# EAGLE design nixie-fader_rev3 (EAGLE 7.2.0)
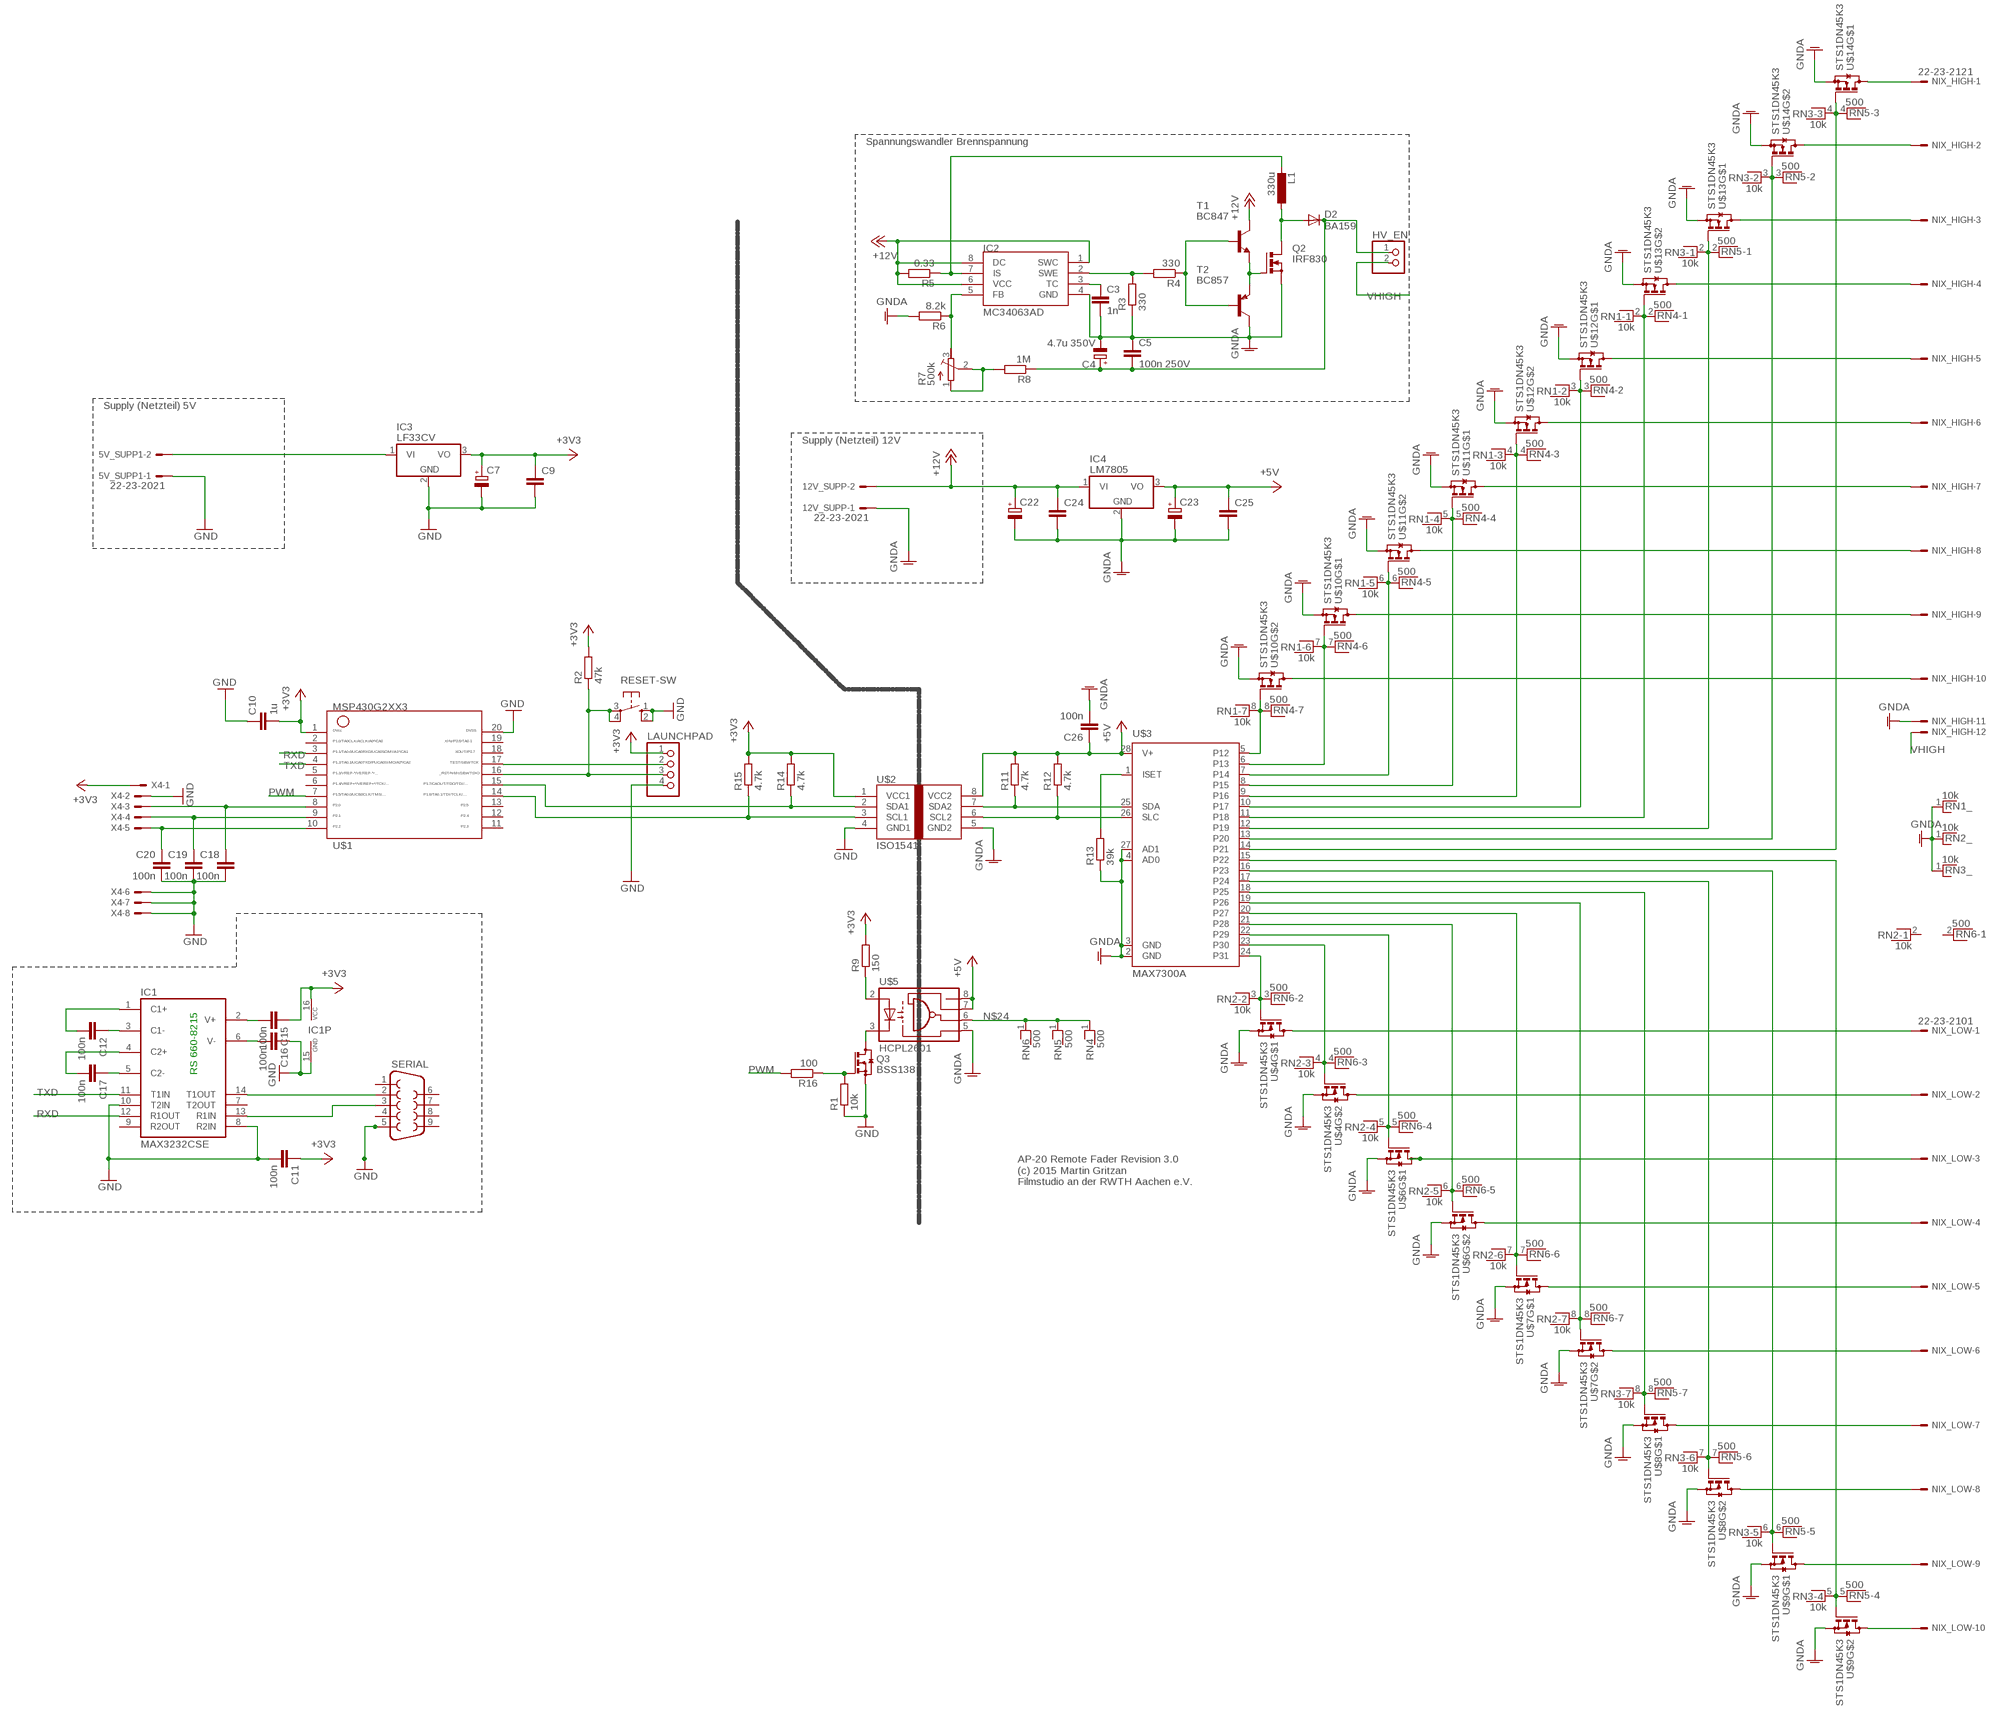
[diagram p0: schematic, sheet 1]

## Parts
5V_SUPP1  22-23-2021  [22-23-2021]
12V_SUPP  22-23-2021  [22-23-2021]
C3  1n  C-EUC0805  [C0805]
C4  4.7u 350V  CPOL-EUE5-8.5  [E5-8,5]
C5  100n 250V  C-EU050-024X044  [C050-024X044]
C7  CPOL-EU140CLH-0810  [140CLH-0810]
C9  C-EUC0805K  [C0805K]
C10  1u  C-EUC0805K  [C0805K]
C11  100n  C-EUC0805  [C0805]
C12  100n  C-EUC0805  [C0805]
C15  100n  C-EUC0805  [C0805]
C16  100n  C-EUC0805  [C0805]
C17  100n  C-EUC0805  [C0805]
C18  100n  C-EUC0805  [C0805]
C19  100n  C-EUC0805  [C0805]
C20  100n  C-EUC0805  [C0805]
C22  CPOL-EU140CLH-0810  [140CLH-0810]
C23  CPOL-EU140CLH-0810  [140CLH-0810]
C24  C-EUC0805K  [C0805K]
C25  C-EUC0805K  [C0805K]
C26  100n  C-EUC0805  [C0805]
D2  BA159  BA157  [P1-10]
HV_EN  PINHD-1X2  [1X02]
IC1  MAX3232CSE  [SO16]
IC2  MC34063AD  [SOIC8]
IC3  LF33CV  7805TV  [TO220V]
IC4  LM7805  7805TV  [TO220V]
L1  330u  L-EUIRF-36  [IRF36]
LAUNCHPAD  PINHD-1X4  [1X04]
NIX_HIGH  22-23-2121  [22-23-2121]
NIX_LOW  22-23-2101  [22-23-2101]
Q2  IRF830  IRF512  [TO220BV]
Q3  BSS138  BSS123  [SOT23]
R1  10k  R-EU_M0805  [M0805]
R2  47k  R-EU_R0805  [R0805]
R3  330  R-EU_M0805  [M0805]
R4  330  R-EU_M0805  [M0805]
R5  0.33  R-EU_M0805  [M0805]
R6  8.2k  R-EU_M0805  [M0805]
R7  500k  R-TRIMM3296Y  [RTRIM3296Y]
R8  1M  R-EU_M0805  [M0805]
R9  150  R-EU_M0805  [M0805]
R11  4.7k  R-EU_M0805  [M0805]
R12  4.7k  R-EU_M0805  [M0805]
R13  39k  R-EU_M0805  [M0805]
R14  4.7k  R-EU_M0805  [M0805]
R15  4.7k  R-EU_M0805  [M0805]
R16  100  R-EU_M0805  [M0805]
RESET-SW  10-XX  [B3F-10XX]
RN1  10k  RNX7  [RN-8]
RN2  10k  RNX7  [RN-8]
RN3  10k  RNX7  [RN-8]
RN4  500  RNX7  [RN-8]
RN5  500  RNX7  [RN-8]
RN6  500  RNX7  [RN-8]
SERIAL  F09H  [F09H]
T1  BC847  [SOT23]
T2  BC857  BC857ASMD  [SOT23-BEC]
U$1  G2XX3---PW20  [PW20]
U$2  ISO1541  [SOIC8]
U$3  MAX7300A  [SSOP28]
U$4  STS1DN45K3  [SO08]
U$5  HCPL2601  [DIP8-SMD]
U$6  STS1DN45K3  [SO08]
U$7  STS1DN45K3  [SO08]
U$8  STS1DN45K3  [SO08]
U$9  STS1DN45K3  [SO08]
U$10  STS1DN45K3  [SO08]
U$11  STS1DN45K3  [SO08]
U$12  STS1DN45K3  [SO08]
U$13  STS1DN45K3  [SO08]
U$14  STS1DN45K3  [SO08]
X4  22-23-2081  [22-23-2081]

## Nets
+3V3: C7.+ C9.1 C10.2 C11.1 C15.1 IC1.16(VCC) IC3.3(VO) LAUNCHPAD.1 R2.2 R9.2 R14.2 R15.2 U$1.1 U$2.1(VCC1) X4.1
+5V: C23.+ C25.1 C26.1 IC4.3(VO) R11.2 R12.2 U$2.8(VCC2) U$3.28(V+) U$5.7(EN) U$5.8(VCC)
+12V: 12V_SUPP.2 C22.+ C24.1 IC2.1(SWC) IC2.6(VCC) IC2.8(DC) IC4.1(VI) R5.2 T1.3(C)
GND: 5V_SUPP1.1 C7.- C9.2 C10.1 C11.2 C16.1 C18.2 C19.2 C20.2 IC1.8(R2IN) IC1.10(T2IN) IC1.15(GND) IC3.2(GND) LAUNCHPAD.4 Q3.2(S) R1.1 RESET-SW.1(S) RESET-SW.2(S1) SERIAL.5 U$1.20 U$2.4(GND1) X4.2 X4.6 X4.7 X4.8
GNDA: 12V_SUPP.1 C3.2 C4.- C5.1 C22.- C23.- C24.2 C25.2 C26.2 IC2.4(GND) IC4.2(GND) NIX_HIGH.11 Q2.S R3.1 R6.2 R13.1 RN1.1 RN2.1 RN3.1 T2.C U$2.5(GND2) U$3.2(GND) U$3.3(GND) U$3.4(AD0) U$3.27(AD1) U$4.1(S) U$4.3(S) U$5.5(GND) U$6.1(S) U$6.3(S) U$7.1(S) U$7.3(S) U$8.1(S) U$8.3(S) U$9.1(S) U$9.3(S) U$10.1(S) U$10.3(S) U$11.1(S) U$11.3(S) U$12.1(S) U$12.3(S) U$13.1(S) U$13.3(S) U$14.1(S) U$14.3(S)
N$1: Q3.1(G) R1.2 R16.1
N$3: C12.1 IC1.3(C1-)
N$5: C3.1 IC2.3(TC)
N$6: IC2.2(SWE) R3.2 R4.2
N$7: R4.1 T1.1(B) T2.B
N$8: C17.1 IC1.5(C2-)
N$9: C17.2 IC1.4(C2+)
N$10: C16.2 IC1.6(V-)
N$11: C15.2 IC1.2(V+)
N$13: LAUNCHPAD.3 R2.1 RESET-SW.3(P) RESET-SW.4(P1) U$1.16
N$14: C12.2 IC1.1(C1+)
N$15: R11.1 U$2.7(SDA2) U$3.25(SDA)
N$16: IC1.14(T1OUT) SERIAL.2
N$17: R12.1 U$2.6(SCL2) U$3.26(SLC)
N$18: Q2.G T1.2(E) T2.E
N$19: D2.A L1.1 Q2.D
N$20: IC2.7(IS) L1.2 R5.1
N$21: IC2.5(FB) R6.1 R7.3(A)
N$22: R7.1(E) R7.2(S) R8.2
N$23: C18.1 U$1.8 X4.3
N$24: RN4.1 RN5.1 RN6.1 U$5.6(OUT)
N$25: C19.1 U$1.9 X4.4
N$26: NIX_HIGH.2 U$14.5(D) U$14.6(D)
N$27: C20.1 U$1.10 X4.5
N$28: Q3.3(D) U$5.3(C)
N$29: R9.1 U$5.2(A)
N$30: RN2.3 RN6.3 U$3.24(P31) U$4.2(G)
N$31: RN1.8 RN4.8 U$3.5(P12) U$10.4(G)
N$32: RN2.4 RN6.4 U$3.23(P30) U$4.4(G)
N$33: RN1.7 RN4.7 U$3.6(P13) U$10.2(G)
N$34: LAUNCHPAD.2 U$1.17
N$35: RN2.5 RN6.5 U$3.22(P29) U$6.2(G)
N$36: RN2.6 RN6.6 U$3.21(P28) U$6.4(G)
N$37: IC1.13(R1IN) SERIAL.3
N$38: R13.2 U$3.1(ISET)
N$39: RN1.6 RN4.6 U$3.7(P14) U$11.4(G)
N$40: RN2.7 RN6.7 U$3.20(P27) U$7.2(G)
N$41: RN2.8 RN6.8 U$3.19(P26) U$7.4(G)
N$42: RN1.5 RN4.5 U$3.8(P15) U$11.2(G)
N$43: RN3.8 RN5.8 U$3.18(P25) U$8.2(G)
N$44: RN3.7 RN5.7 U$3.17(P24) U$8.4(G)
N$45: RN1.4 RN4.4 U$3.9(P16) U$12.4(G)
N$46: RN3.6 RN5.6 U$3.16(P23) U$9.2(G)
N$47: RN3.5 RN5.5 U$3.15(P22) U$9.4(G)
N$48: NIX_HIGH.1 U$14.7(D) U$14.8(D)
N$49: NIX_LOW.1 U$4.7(D) U$4.8(D)
N$50: NIX_LOW.2 U$4.5(D) U$4.6(D)
N$51: R14.1 U$1.15 U$2.2(SDA1)
N$52: NIX_LOW.3 U$6.7(D) U$6.8(D)
N$53: NIX_LOW.4 U$6.5(D) U$6.6(D)
N$54: NIX_LOW.5 U$7.7(D) U$7.8(D)
N$55: NIX_LOW.6 U$7.5(D) U$7.6(D)
N$56: NIX_LOW.7 U$8.7(D) U$8.8(D)
N$57: NIX_LOW.8 U$8.5(D) U$8.6(D)
N$58: NIX_LOW.9 U$9.7(D) U$9.8(D)
N$59: R15.1 U$1.14 U$2.3(SCL1)
N$60: NIX_LOW.10 U$9.5(D) U$9.6(D)
N$61: RN1.3 RN4.3 U$3.10(P17) U$12.2(G)
N$63: RN1.2 RN4.2 U$3.11(P18) U$13.4(G)
N$64: RN3.2 RN5.2 U$3.12(P19) U$13.2(G)
N$65: RN3.3 RN5.3 U$3.13(P20) U$14.4(G)
N$67: 5V_SUPP1.2 IC3.1(VI)
N$68: RN3.4 RN5.4 U$3.14(P21) U$14.2(G)
N$69: NIX_HIGH.3 U$13.7(D) U$13.8(D)
N$70: NIX_HIGH.4 U$13.5(D) U$13.6(D)
N$71: NIX_HIGH.5 U$12.7(D) U$12.8(D)
N$72: NIX_HIGH.6 U$12.5(D) U$12.6(D)
N$73: NIX_HIGH.7 U$11.7(D) U$11.8(D)
N$74: NIX_HIGH.8 U$11.5(D) U$11.6(D)
N$75: NIX_HIGH.9 U$10.7(D) U$10.8(D)
N$76: NIX_HIGH.10 U$10.5(D) U$10.6(D)
PWM: R16.2 U$1.7
RXD: IC1.12(R1OUT) U$1.3
TXD: IC1.11(T1IN) U$1.4
VHIGH: HV_EN.2 NIX_HIGH.12
VHIGH_SUP: C4.+ C5.2 D2.C HV_EN.1 R8.1
Unconnected: IC1.7(T2OUT) IC1.9(R2OUT) RN2.2 RN6.2 SERIAL.1 SERIAL.4 SERIAL.6 SERIAL.7 SERIAL.8 SERIAL.9 U$1.2 U$1.5 U$1.6 U$1.11 U$1.12 U$1.13 U$1.18 U$1.19

## Notes on the sheet
- Spannungswandler Brennspannung
- Supply (Netzteil) 5V
- Supply (Netzteil) 12V
- RS 660-8215
- AP-20 Remote Fader Revision 3.0
  (c) 2015 Martin Gritzan
  Filmstudio an der RWTH Aachen e.V.

## Library data of the parts
5V_SUPP1 12V_SUPP = con-molex:22-23-2021: .100" (2.54mm) Center Header - 2 Pin; MF: MOLEX; MPN: 22-23-2021; OC_FARNELL: 1462926; OC_NEWARK: 25C3832
C3 C11 C12 C15-C20 C26 = resistor:C-EU: CAPACITOR, European symbol
C4 = resistor:CPOL-EU: POLARIZED CAPACITOR, European symbol
C5 C9 C10 C24 C25 = rcl:C-EU: CAPACITOR, European symbol
C7 C22 C23 = rcl:CPOL-EU: POLARIZED CAPACITOR, European symbol
D2 = diode:BA157: DIODE fast soft-recovery controlled avalanche rectifier
HV_EN = pinhead:PINHD-1X2: PIN HEADER
IC1 = maxim:MAX3232*: True RS-232 Transceivers 3.0V to 5.5V, Low-Power up to 1Mbps, Using Four 0.1µF External Capacitors Source: http://pdfserv.maxim-ic.com/en/ds/MAX3222-MAX3241.pdf; MPN: MAX3232CSE; OC_FARNELL: 9725490; OC_NEWARK: 90C2890
IC2 = mc34063:MC34063
IC3 IC4 = linear:78*: Positive VOLTAGE REGULATOR Source: http://cache.national.com/ds/LM/LM78L05.pdf http://www.fairchildsemi.com/ds/LM/LM7805.pdf
L1 = rcl:L-EU: INDUCTOR, European symbol
LAUNCHPAD = pinhead:PINHD-1X4: PIN HEADER
NIX_HIGH = con-molex:22-23-2121: .100" (2.54mm) Center Header - 12 Pin; MF: MOLEX; MPN: 22-23-2121; OC_FARNELL: 1462935; OC_NEWARK: 56H0456
NIX_LOW = con-molex:22-23-2101: .100" (2.54mm) Center Header - 10 Pin; MF: MOLEX; MPN: 22-23-2101; OC_FARNELL: 1756828; OC_NEWARK: 94C0765
Q2 = transistor-power:IRF512: N-CHANNEL MOS FET
Q3 = transistor-small-signal:BSS123: N-CHANNEL MOS FET
R1-R6 R8 R9 R11-R16 = resistor:R-EU_: RESISTOR, European symbol
R7 = resistor:R-TRIMM: Trimm resistor
RESET-SW = switch-omron:10-XX: OMRON SWITCH; MPN: B3F-1000; OC_FARNELL: 176432; OC_NEWARK: 36M3542
RN1-RN6 = resistor-net:RNX7: RESISTOR NETWORK; OC_FARNELL: unknown; OC_NEWARK: unknown
SERIAL = con-subd:F09: SUB-D; OC_FARNELL: unknown; OC_NEWARK: unknown
T1 = transistor:BC847: NPN TRANSISTOR
T2 = transistor-pnp:BC857*: PNP Transistror
U$1 = TI_MSP430_v16:G2XX3---PW20: MSP430G2XX1 TSSOP (PW) 20 Pin Package
U$2 = Standardbauteile_Martin:ISO1541
U$3 = Standardbauteile_Martin:MAX7300A
U$4 U$6-U$14 = Standardbauteile_Martin:STS1DN45K3: outdated dual-MOSFET with >400V rating in SO08-Package
U$5 = Standardbauteile_Martin:HCPL2601
X4 = con-molex:22-23-2081: .100" (2.54mm) Center Header - 8 Pin; MF: MOLEX; MPN: 22-23-2081; OC_FARNELL: 1756826; OC_NEWARK: 01C7592

## Board
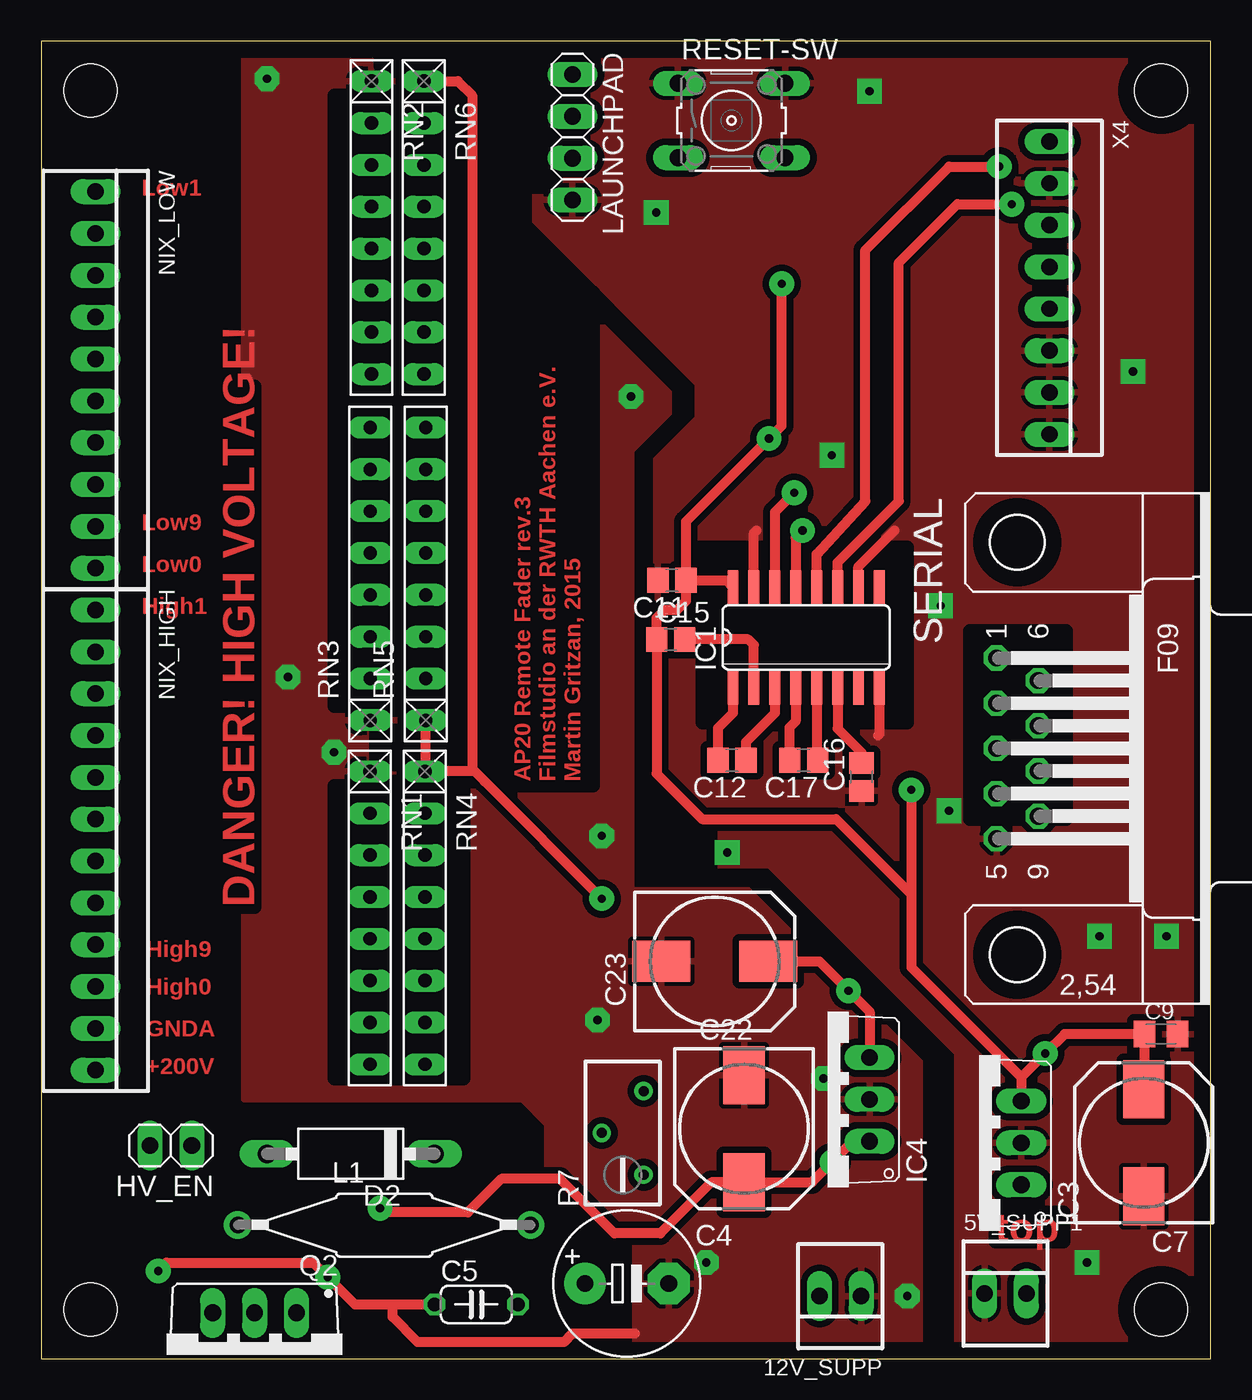
[diagram p1: board, top side]
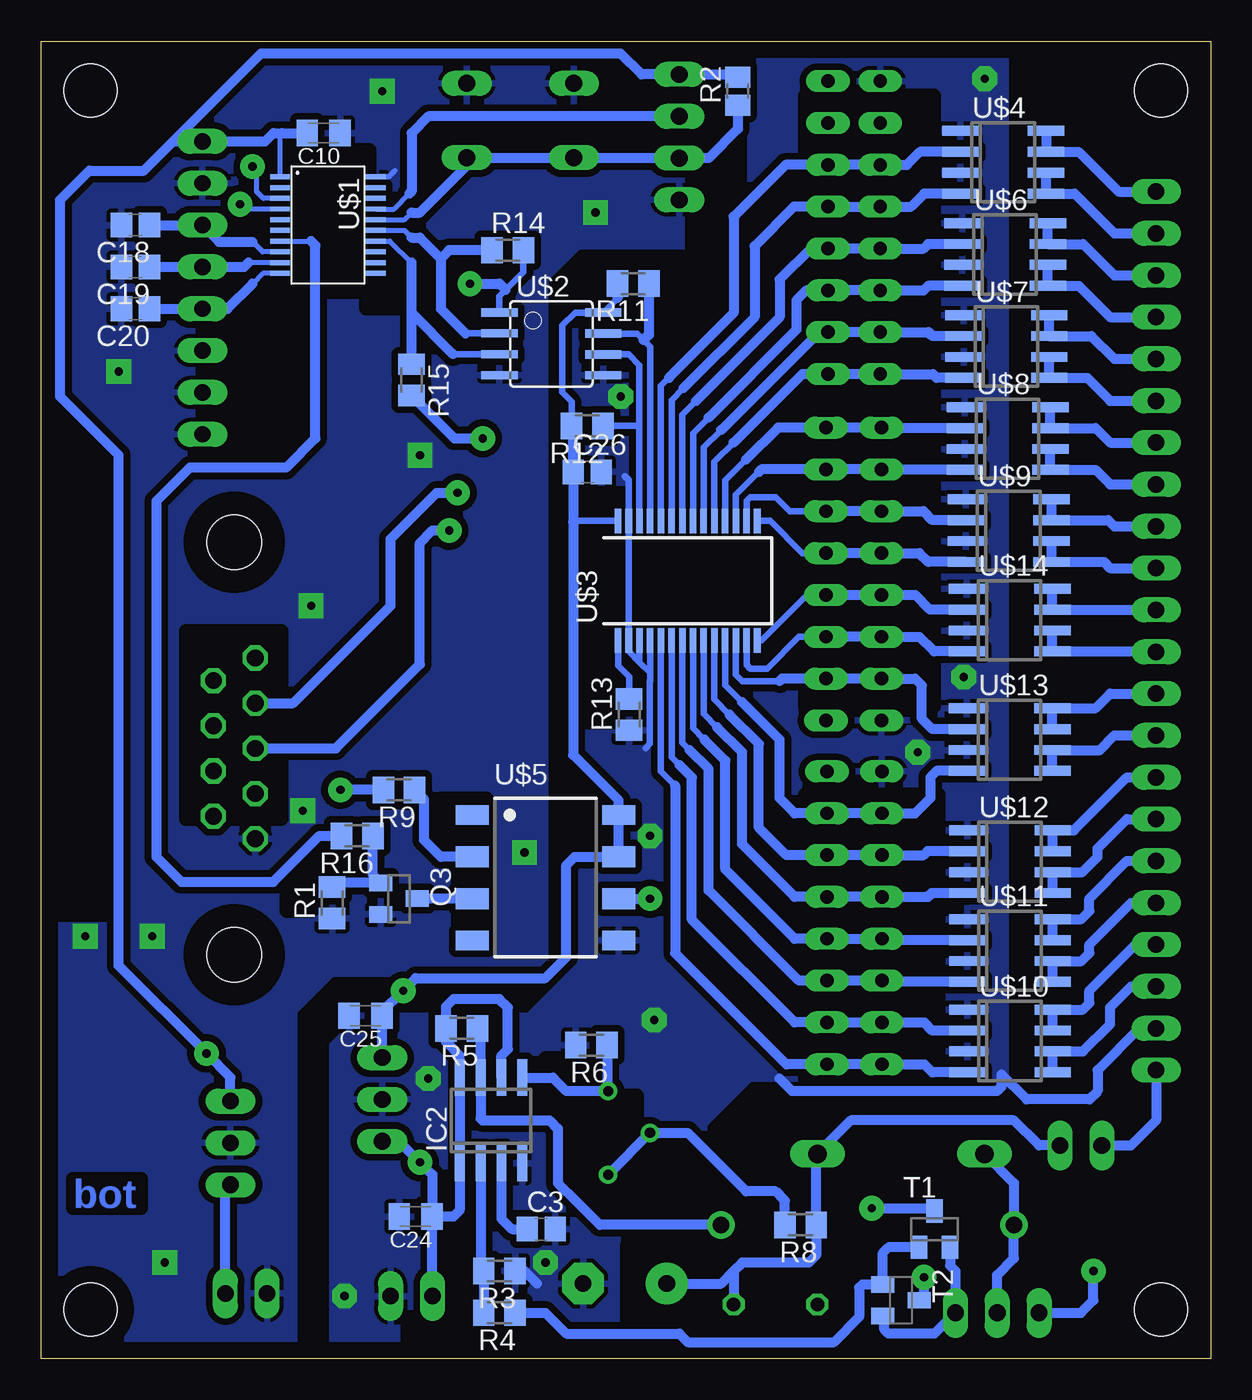
[diagram p2: board, bottom side, seen from below]

Size 71 x 80 mm. Coordinates in mm from the lower left corner, seen from the top.
Outline: 0,0 71,0 71,80 0,80 0,0
Copper layers (1*16): Top 0.035mm / dielectric 1.5mm / Bottom 0.035mm
Design rules "default *": minimum track width 10mil, minimum drill 24mil, track to track 8mil, track to pad 8mil, pad to pad 8mil, via to via 8mil, smd to smd 8mil, copper to edge 40mil, drill to drill 8mil, minimum pad ring 10mil, minimum via ring 8mil, stop-mask expansion 4mil, vias tented up to drill 0mil, thermal gap 10mil
Holes 3.2 mm at 3,77 3,3 68,3 68,77
tRestrict: area 40.1,38.6 to 52.6,49.3; area 17.8,39.6 to 25.4,76.7; area 17.8,17 to 25.7,34.8; area 20.6,78.5 to 21.6,79; area 20.3,36.1 to 22.6,38.1; area 29.5,71.1 to 31.2,72.4; area 39.6,29.2 to 40.6,33; area 27.7,34.8 to 33.5,64.8; area 56.4,32.8 to 62.2,44.2
bRestrict: area 26.2,41.7 to 37.6,52.6; area 51.1,64.8 to 56.4,73.4; area 16.8,39.6 to 24.6,76.7; area 16.5,16.8 to 24.6,34.3; area 34.8,13.5 to 36.6,16; area 46.2,1 to 48.8,2.5; area 43.9,28.7 to 45.7,29.7; area 43.9,31.2 to 46.7,34; area 43.9,26.2 to 45.7,27.2; area 54.6,27.2 to 56.1,29.7; area 56.4,32.8 to 62.2,44.2; area 59.2,54.9 to 61.2,63; 6 more areas

### Footprints (pad centres in the part's own frame; a part is rotated, then mirrored left to right if it is on the bottom)
22-23-2021 = drill 1 long: 1 -1.27,0; 2 1.27,0
C0805 = smd 1.3 x 1.5: 1 -0.85,0; 2 0.85,0
E5-8,5 = drill 1.016 pad 2.54: + -2.54,0 | drill 1.016 pad 2.54 octagon: - 2.54,0
C050-024X044 = drill 0.813 octagon: 1 -2.54,0; 2 2.54,0
140CLH-0810 = smd 3.5 x 2.5: + 3.25,0; - -3.25,0
C0805K = smd 1.3 x 1.6: 1 -1,0; 2 1,0
P1-10 = drill 1.118 long: A 5.08,0; C -5.08,0
1X02 = drill 1.016 long: 1 -1.27,0; 2 1.27,0
SO16 = smd 0.66 x 2.032: 1 -4.445,-3.073; 2 -3.175,-3.073; 3 -1.905,-3.073; 4 -0.635,-3.073; 5 0.635,-3.073; 6 1.905,-3.073; 7 3.175,-3.073; 8 4.445,-3.073; 9 4.445,3.073; 10 3.175,3.073; 11 1.905,3.073; 12 0.635,3.073; 13 -0.635,3.073; 14 -1.905,3.073; 15 -3.175,3.073; 16 -4.445,3.073
SOIC8 = smd 0.6 x 2.2: 1 -1.905,-2.6; 2 -0.635,-2.6; 3 0.635,-2.6; 4 1.905,-2.6; 5 1.905,2.6; 6 0.635,2.6; 7 -0.635,2.6; 8 -1.905,2.6
TO220V = drill 1.016 long: 1 -2.54,-2.54; 2 0,-2.54; 3 2.54,-2.54
IRF36 = drill 1 pad 1.676: 1 -8.89,0; 2 8.89,0
1X04 = drill 1.016 long: 1 -3.81,0; 2 -1.27,0; 3 1.27,0; 4 3.81,0
22-23-2121 = drill 1 long: 1 -13.97,0; 2 -11.43,0; 3 -8.89,0; 4 -6.35,0; 5 -3.81,0; 6 -1.27,0; 7 1.27,0; 8 3.81,0; 9 6.35,0; 10 8.89,0; 11 11.43,0; 12 13.97,0
22-23-2101 = drill 1 long: 1 -11.43,0; 2 -8.89,0; 3 -6.35,0; 4 -3.81,0; 5 -1.27,0; 6 1.27,0; 7 3.81,0; 8 6.35,0; 9 8.89,0; 10 11.43,0
TO220BV = drill 1.016 long: D 0,-2.54; G -2.54,-2.54; S 2.54,-2.54
SOT23 = smd 1 x 1.4: 1 -0.95,-1.1; 2 0.95,-1.1; 3 0,1.1
M0805 = smd 1.3 x 1.6: 1 -0.95,0; 2 0.95,0
R0805 = smd 1.3 x 1.5: 1 -0.85,0; 2 0.85,0
RTRIM3296Y = drill 0.61: 1 1.27,-2.54; 2 -1.27,0; 3 1.27,2.54
B3F-10XX = drill 1.016 long: 1 -3.251,2.261; 2 3.251,2.261; 3 -3.251,-2.261; 4 3.251,-2.261
RN-8 = drill 0.813 long: 1 -8.89,0; 2 -6.35,0; 3 -3.81,0; 4 -1.27,0; 5 1.27,0; 6 3.81,0; 7 6.35,0; 8 8.89,0
F09H = drill 1.016 octagon: 1 -5.486,-1.27; 2 -2.743,-1.27; 3 0,-1.27; 4 2.743,-1.27; 5 5.486,-1.27; 6 -4.115,1.27; 7 -1.372,1.27; 8 1.372,1.27; 9 4.115,1.27 | hole 3.302: -12.522,0; 12.522,0
SOT23-BEC = smd 1 x 1.4: B -0.95,-1.1; C 0,1.1; E 0.95,-1.1
PW20 = smd 0.3 x 1.2: 1 -2.925,-2.9; 2 -2.275,-2.9; 3 -1.625,-2.9; 4 -0.975,-2.9; 5 -0.325,-2.9; 6 0.325,-2.9; 7 0.975,-2.9; 8 1.625,-2.9; 9 2.275,-2.9; 10 2.925,-2.9; 11 2.925,2.9; 12 2.275,2.9; 13 1.625,2.9; 14 0.975,2.9; 15 0.325,2.9; 16 -0.325,2.9; 17 -0.975,2.9; 18 -1.625,2.9; 19 -2.275,2.9; 20 -2.925,2.9
SOIC8' = smd 0.5 x 2.2: 1 -1.905,-3.154; 2 -0.645,-3.154; 3 0.625,-3.154; 4 1.895,-3.154; 5 1.905,3.154; 6 0.635,3.154; 7 -0.635,3.154; 8 -1.905,3.154
SSOP28 = smd 0.4 x 1.5: 1 -4.225,-3.625; 2 -3.575,-3.625; 3 -2.925,-3.625; 4 -2.275,-3.625; 5 -1.625,-3.625; 6 -0.975,-3.625; 7 -0.325,-3.625; 8 0.325,-3.625; 9 0.975,-3.625; 10 1.625,-3.625; 11 2.275,-3.625; 12 2.925,-3.625; 13 3.575,-3.625; 14 4.225,-3.625; 15 4.225,3.625; 16 3.575,3.625; 17 2.925,3.625; 18 2.275,3.625; 19 1.625,3.625; 20 0.975,3.625; 21 0.325,3.625; 22 -0.325,3.625; 23 -0.975,3.625; 24 -1.625,3.625; 25 -2.275,3.625; 26 -2.925,3.625; 27 -3.575,3.625; 28 -4.225,3.625
SO08 = smd 0.6 x 2.2: 1 -1.905,-2.6; 2 -0.635,-2.6; 3 0.635,-2.6; 4 1.905,-2.6; 5 1.905,2.6; 6 0.635,2.6; 7 -0.635,2.6; 8 -1.905,2.6
DIP8-SMD = smd 1.16 x 2: 1 -3.81,-4.45; 4 3.81,-4.45; 5 3.81,4.45; 8 -3.81,4.45 | smd 1.27 x 2: 2 -1.27,-4.45; 3 1.27,-4.45; 6 1.27,4.45; 7 -1.27,4.45
22-23-2081 = drill 1 long: 1 -8.89,0; 2 -6.35,0; 3 -3.81,0; 4 -1.27,0; 5 1.27,0; 6 3.81,0; 7 6.35,0; 8 8.89,0

### Placement (x,y rotation side)
5V_SUPP1  58.55,3.97 0 top
12V_SUPP  48.51,3.81 180 top
C3  40.64,7.87 0 bottom
C4  35.56,4.57 0 top
C5  26.42,3.3 0 top
C7  66.94,13.12 90 top
C9  68,19.72 0 top
C10  53.85,74.42 180 bottom
C11  38.29,47.27 180 top
C12  41.95,36.34 180 top
C15  38.22,43.67 0 top
C16  49.81,35.33 90 top
C17  46.3,36.34 180 top
C18  65.28,68.83 180 bottom
C19  65.28,66.29 180 bottom
C20  65.28,63.75 180 bottom
C22  42.67,13.97 270 top
C23  40.89,24.13 0 top
C24  48.26,8.64 180 bottom
C25  51.31,20.83 180 bottom
C26  37.85,53.85 0 bottom
D2  18.8,12.45 180 top
HV_EN  7.87,12.95 180 top
IC1  46.45,43.8 0 top
IC2  43.69,14.48 0 bottom
IC3  56.97,13.11 90 top
IC4  47.75,15.75 90 top
L1  20.83,8.13 0 top
LAUNCHPAD  32.26,74.17 270 top
NIX_HIGH  3.3,31.5 270 top
NIX_LOW  3.3,59.44 270 top
Q2  12.95,0.25 180 top
Q3  49.28,27.94 270 bottom
R1  53.34,27.69 90 bottom
R2  28.7,76.96 90 bottom
R3  43.18,5.33 180 bottom
R4  43.18,2.79 180 bottom
R5  45.47,20.07 180 bottom
R6  37.59,19.05 180 bottom
R7  35.31,13.72 0 top
R8  24.89,8.13 180 bottom
R9  49.28,34.54 180 bottom
R11  35.05,65.28 180 bottom
R12  37.85,56.64 180 bottom
R13  35.31,39.12 90 bottom
R14  42.67,67.31 0 bottom
R15  48.51,59.44 270 bottom
R16  51.82,31.75 180 bottom
RESET-SW  41.91,75.18 0 top
RN1  19.96,26.77 270 top
RN2  20.05,68.68 270 top
RN3  19.98,47.65 90 top
RN4  23.29,26.77 270 top
RN5  23.35,47.65 90 top
RN6  23.23,68.68 270 top
SERIAL  59.27,37.06 270 top
T1  16.76,7.87 0 bottom
T2  18.8,3.56 270 bottom
U$1  53.59,68.83 270 bottom
U$2  ISO1541  [SOIC8']  40.03,61.62 270 bottom
U$3  31.75,47.24 0 bottom
U$4  12.59,72.65 270 bottom
U$5  40.39,29.21 270 bottom
U$6  12.47,67.05 270 bottom
U$7  12.4,61.46 270 bottom
U$8  12.33,55.87 270 bottom
U$9  12.25,50.29 270 bottom
U$10  12.18,19.3 270 bottom
U$11  12.18,24.79 270 bottom
U$12  12.18,30.19 270 bottom
U$13  12.2,37.6 270 bottom
U$14  12.2,44.85 270 bottom
X4  61.21,65.02 270 top

### Tracks (layer width: path | path; a pad name or v marks a point on that pad's centre or on a via)
+3V3  (via drill 0.5 pad 1.5)
  Top 0.61: C11.1 41.61,47.27 IC1.16 | C11.1 39.14,46 38.61,45.47 37.85,45.47 37.37,44.99 C15.1 37.37,35.53 40.13,32.77 48.26,32.77 52.83,28.19 | C7.+ 67,16.43 C9.1 62.14,19.72 v60.96,18.54 59.51,17.09 | 59.51,17.09 IC3.3 | 52.83,28.19 52.83,23.76 59.51,17.09 | v52.83,34.54 52.83,28.19 | C11.1 39.14,50.83 v44.2,55.88 44.96,56.64 v44.96,65.28
  Bottom 0.305: U$1.1 56.49,74.32 56.39,74.42
  Bottom 0.406: U$2.1 43.18,64.52 42.8,64.9 41.72,65.97 R14.2
  Bottom 0.61: C10.2 56.39,74.42 56.9,74.42 57.4,73.91 X4.1 62.99,73.91 | IC3.3 59.51,17.09 v60.96,18.54 66.29,23.88 66.29,54.86 69.85,58.42 69.85,70.36 68.07,72.14 64.77,72.14 62.99,73.91 | 62.99,73.91 57.66,79.25 35.81,79.25 34.54,77.98 LAUNCHPAD.1 28.87,77.98 R2.2 | R9.2 v52.83,34.54 | R15.2 45.91,55.88 v44.2,55.88 | v44.96,65.28 43.18,65.28 42.8,64.9
+5V  (via drill 0.5 pad 1.5)
  Top 0.61: C23.+ 47.24,24.13 v49.02,22.35 50.29,21.08 IC4.3
  Bottom 0.406: 36,64.39 U$2.8 38.59,63.52 39.37,62.74 39.37,58.67 38.8,58.1 R12.2 | U$3.28 38.63,50.87 38.7,50.8
  Bottom 0.61: R11.2 36,64.39 | R12.2 38.7,56.54 C26.1 38.7,50.8 38.7,36.66 35.94,33.9 U$5.8 U$5.7 38.61,30.48 39.12,29.97 39.12,24.38 40.39,23.11 48.26,23.11 v49.02,22.35 50.31,21.07 C25.1 50.29,20.81 IC4.3
+12V  (via drill 0.5 pad 1.5)
  Top 0.61: v20.57,9.14 20.83,8.89 25.91,8.89 27.94,10.92 31.5,10.92 34.8,7.62 37.59,7.62 40.69,10.72 C22.+ 46.79,10.72 v48.01,11.94 49.28,13.21 IC4.1
  Bottom 0.61: IC2.6 43.05,18.41 42.67,18.8 42.67,21.34 43.18,21.84 45.97,21.84 46.42,21.4 R5.2 46.42,19.24 45.59,18.41 IC2.8 IC2.1 45.59,9.02 45.97,8.64 C24.1 | 12V_SUPP.2 47.24,8.62 C24.1 | IC4.1 49.28,13.21 v48.01,11.94 47.24,11.18 47.24,8.65 C24.1 | v20.57,9.14 16.93,9.14 T1.3
GND  (via drill 0.5 pad 1.5)
  Top 0.61: IC1.15 43.27,50.13 43.43,50.29 | IC1.10 49.62,48.1 51.82,50.29 | IC1.8 50.89,37.94 50.8,37.85
  Bottom 0.305: U$1.20 49.91,71.76 49.53,72.14
  other vias: 37.34,69.6 50.29,76.96 66.29,59.94 54.61,45.72 55.12,33.27 63.5,5.84 68.33,25.65 64.26,25.65 41.66,30.73 48.01,54.86
  pour Bottom (isolate 0.406): 71,0 71,80 30,80 30,69.31 31.75,67.56 38.35,67.56 40.39,65.53 40.39,24.13 41.15,23.37 53.34,23.37 55.63,21.08 55.63,0
  pour Top (isolate 0.406): 71,0 71,80 30,80 30,69.06 39.88,59.18 39.88,57.15 37.34,54.61 37.34,29.97 44.2,29.97 55.63,18.54 55.63,0
GNDA  (via drill 0.5 pad 1.5)
  Top 0.61: v7.11,5.33 7.62,5.84 16.51,5.84 v17.4,4.95 19.05,3.3 21.34,3.3 | 21.34,3.3 C5.1 | 36.07,1.52 32.26,1.52 31.75,1.02 22.86,1.02 21.34,2.54 21.34,3.3
  Bottom 0.406: U$3.4 34.02,41.66 | 34.02,41.66 34.02,41.16 34.04,41.15 34.04,37.34 34.29,37.08 | U$3.3 34.67,42.31 | 34.67,42.31 34.02,41.66 | 34.67,42.31 35.33,42.96 U$3.2 U$3.27 35.33,53.36 35.56,53.59
  Bottom 0.61: 26.16,17.02 25.4,16.26 12.95,16.26 12.7,16.51 12.7,17.27 11.18,15.75 7.37,15.75 6.86,16.26 6.86,17.53 4.32,20.07 NIX_HIGH.11 | Q2.S 7.87,2.79 7.11,3.56 v7.11,5.33 | T2.C 17.4,3.85 v17.4,4.95 | R3.1 41.66,5.33 40.89,4.57
  other vias: 34.04,31.75 33.78,20.57 52.58,3.81 13.72,77.72 17.78,36.83 14.99,41.4 35.81,58.42 47.5,17.02 40.39,5.84
  pour Top (isolate 0.406): 53.34,0 53.34,18.03 42.93,28.45 35.81,28.45 35.81,55.12 38.1,57.4 38.1,58.67 27.94,68.83 27.94,80.01 12.33,80.01 12.33,15.75 29.21,15.75 30.73,14.22 30.73,10.16 33.53,7.37 35.81,7.37 36.07,7.11 36.07,0
  pour Bottom (isolate 0.406): 53.34,0 53.34,19.05 51.56,20.83 41.4,20.83 39.12,23.11 39.12,64.01 37.34,65.79 31.24,65.79 28.7,68.33 27.94,69.09 27.94,80.01 15.75,80.01 12.45,80.01 12.45,17.02 27.94,17.02 30.73,14.22 30.73,10.16 33.53,7.37 35.81,7.37 36.07,7.11 36.07,0
N$1
  Bottom 0.61: 50.36,28.91 Q3.1 | Q3.1 53.09,28.89 R1.2 | Q3.1 50.87,29.38 R16.1
N$2  (via drill 0.5 pad 1.5)
  other vias: 3,3
N$3
  Top 0.61: IC1.3 44.54,39.21 42.8,37.46 C12.1
N$4  (via drill 0.5 pad 1.5)
  other vias: 68,3
N$5
  Bottom 0.61: IC2.3 43.05,8.51 42.42,7.87 C3.1
N$6
  Bottom 0.61: IC2.2 44.32,5.53 R3.2 R4.2
N$7
  Bottom 0.61: T1.1 19.56,6.77 19.9,6.44 T2.B 21.15,4.51 21.34,4.32 21.34,2.54 22.86,1.02 31.75,1.02 32.26,1.52 39.12,1.52 40.39,2.79 R4.1
N$8
  Top 0.61: IC1.5 47.08,36.41 C17.1
N$9
  Top 0.61: IC1.4 45.81,38.7 45.45,38.34 C17.2
N$10
  Top 0.61: IC1.6 48.35,38.26 49.81,36.81 C16.2
N$11
  Top 0.406: 39.09,43.69 C15.2
  Top 0.61: IC1.2 43.27,43.34 42.93,43.69 39.09,43.69
N$12  (via drill 0.5 pad 1.5)
  other vias: 68,77
N$13
  Bottom 0.305: U$1.16 48.95,69.16 48.51,69.6
  Bottom 0.61: 48.51,69.6 48.01,69.6 45.16,72.44 RESET-SW.4 RESET-SW.3 38.63,72.9 LAUNCHPAD.3 30.48,72.9 28.7,74.68 R2.1
N$14
  Top 0.61: IC1.1 42,39.21 41.1,38.3 C12.2
N$15
  Bottom 0.406: U$3.25 34.02,61.46 34.42,61.85 34.8,62.23 36.85,62.23 U$2.7
  Bottom 0.61: R11.1 34.1,62.16 34.42,61.85
N$16  (via drill 0.5 pad 1.5)
  Top 0.61: v45.72,52.58 44.54,51.4 IC1.14
  Bottom 0.61: SERIAL.2 55.7,39.8 49.78,45.72 49.78,49.78 46.99,52.58 v45.72,52.58
N$17
  Bottom 0.406: U$3.26 34.67,56.64 | 34.67,56.64 34.67,60.33 35.33,60.98 U$2.6 | R12.1 34.67,56.64
N$18
  Bottom 0.61: T1.2 15.81,5.65 15.49,5.33 Q2.G 16.76,1.52 19.56,1.52 19.81,1.78 19.81,2.52 T2.E
N$19
  Bottom 0.61: Q2.D 12.95,5.08 11.94,6.1 L1.1 11.94,10.67 D2.A
N$20
  Bottom 0.406: 44.32,19.87 R5.1 | 44.32,14.61 44.2,14.48
  Bottom 0.61: 44.32,19.87 IC2.7 44.32,14.61 | 44.2,14.48 40.13,14.48 39.62,13.97 39.62,10.67 38.48,9.53 38.1,9.14 37.08,8.13 L1.2
N$21
  Bottom 0.406: 39.94,17.08 39.88,17.02
  Bottom 0.61: IC2.5 39.94,17.08 | 39.88,17.02 39.12,16.26 R7.3 36.64,16.32 R6.1
N$22
  Bottom 0.61: R8.2 25.84,9.59 26.42,10.16 28.19,10.16 31.75,13.72 R7.2 R7.1
N$23
  Bottom 0.305: U$1.8 57.56,67.21 58.17,67.82
  Bottom 0.61: C18.1 X4.3 60.2,67.82 58.17,67.82
N$24  (via drill 0.5 pad 1.5)
  Top 0.61: v34.04,27.94 26.92,35.05 26.31,35.66 | 26.31,35.66 RN4.1 23.35,35.71 RN5.1 | RN6.1 25.3,77.57 26.16,76.71 26.16,35.81 26.31,35.66
  Bottom 0.61: U$5.6 v34.04,27.94
N$25
  Bottom 0.305: U$1.9 58.41,66.56 58.42,66.55
  Bottom 0.61: C19.1 X4.4 58.67,66.29 58.42,66.55
N$26
  Bottom 0.61: NIX_HIGH.2 3.33,42.95 U$14.5 U$14.6
N$27
  Bottom 0.305: U$1.10 57.53,65.91 58.17,65.28
  Bottom 0.61: C20.1 X4.5 59.69,63.75 58.17,65.28
N$28
  Bottom 0.61: U$5.3 Q3.3
N$29
  Bottom 0.61: U$5.2 46.74,30.48 47.75,31.5 47.75,33.97 R9.1
N$30
  Bottom 0.406: U$3.24 33.38,59.08 32.89,59.56 32.77,59.69
  Bottom 0.61: U$4.2 17.65,73.28 18.44,72.49 RN2.3 RN6.3 25.81,72.49 28.96,69.34 28.96,63.5 32.89,59.56
N$31
  Bottom 0.406: U$3.5 33.38,35.66 32.51,34.8
  Bottom 0.61: U$10.4 16.89,17.39 17.37,17.88 RN1.8 RN4.8 25.76,17.88 32.51,24.64 32.51,34.8
N$32
  Bottom 0.406: U$3.23 32.73,58.21 32,58.93
  Bottom 0.61: U$4.4 17.39,70.75 18.19,69.95 RN2.4 RN6.4 25.3,69.95 27.69,67.56 27.69,63.25 32,58.93
N$33
  Bottom 0.406: U$3.6 32.73,36.53 32.26,36.07
  Bottom 0.61: U$10.2 16.89,19.93 17.37,20.42 RN1.7 RN4.7 25.25,20.42 31.5,26.67 31.5,35.31 32.26,36.07
N$34
  Bottom 0.305: U$1.17 49.57,69.81 48.64,70.74
  Bottom 0.61: LAUNCHPAD.2 47.5,75.44 48.51,74.42 48.51,70.87 48.64,70.74
N$35
  Bottom 0.406: U$3.22 32.08,57.33 31.24,58.17
  Bottom 0.61: U$6.2 17.15,67.69 17.42,67.41 RN2.5 RN6.5 24.28,67.41 26.16,65.53 26.16,63.25 31.24,58.17
N$36
  Bottom 0.406: U$3.21 31.43,56.2 30.48,57.15
  Bottom 0.61: U$6.4 17.15,65.14 17.42,64.87 RN2.6 RN6.6 24.54,64.87 25.15,64.26 25.15,62.48 30.48,57.15
N$37  (via drill 0.5 pad 1.5)
  Top 0.61: v46.23,50.29 45.81,49.88 IC1.13
  Bottom 0.61: SERIAL.3 53.11,37.06 48.01,42.16 48.01,49.53 47.24,50.29 v46.23,50.29
N$38
  Bottom 0.406: U$3.1 35.98,42.07 35.31,41.4 R13.2
N$39
  Bottom 0.406: U$3.7 32.08,37.41 31.62,36.96 31.5,36.83
  Bottom 0.61: U$11.4 19.88,22.88 RN1.6 RN4.6 24.99,22.96 30.48,28.45 30.48,35.81 31.62,36.96
N$40
  Bottom 0.406: U$3.20 30.77,55.33 29.72,56.39
  Bottom 0.61: U$7.2 16.89,62.1 17.12,62.33 RN2.7 RN6.7 23.77,62.33 29.72,56.39
N$41
  Bottom 0.406: U$3.19 30.12,54.46 28.96,55.63
  Bottom 0.61: U$7.4 16.63,59.56 16.87,59.79 RN2.8 RN6.8 24.79,59.79 28.96,55.63
N$42
  Bottom 0.406: U$3.8 31.43,38.28 30.73,37.59
  Bottom 0.61: U$11.2 19.88,25.42 RN1.5 RN4.5 25.25,25.5 29.46,29.72 29.46,36.32 30.73,37.59
N$43
  Bottom 0.406: U$3.18 29.48,53.33 28.19,54.61
  Bottom 0.61: U$8.2 19.95,56.51 RN3.8 RN5.8 26.26,56.54 28.19,54.61
N$44
  Bottom 0.406: U$3.17 28.82,52.45 27.43,53.85
  Bottom 0.61: U$8.4 19.95,53.97 RN3.7 RN5.7 27.28,54 27.43,53.85
N$45
  Bottom 0.406: U$3.9 30.77,39.16 29.97,38.35
  Bottom 0.61: U$12.4 16.93,28.28 17.17,28.04 RN1.4 RN4.4 25.25,28.04 28.45,31.24 28.45,36.83 29.97,38.35
N$46
  Bottom 0.406: U$3.16 28.18,52.09 27.94,52.32 26.42,52.32 25.55,51.46 RN5.6
  Bottom 0.61: U$9.2 16.89,50.92 17.42,51.46 RN3.6 RN5.6
N$47
  Bottom 0.406: U$3.15 26.74,50.87 24.79,48.92 RN5.5
  Bottom 0.61: U$9.4 17.14,48.38 17.68,48.92 RN3.5 RN5.5
N$48
  Bottom 0.61: NIX_HIGH.1 3.33,45.49 U$14.7 U$14.8
N$49
  Bottom 0.61: NIX_LOW.1 5.59,70.87 8.01,73.28 U$4.7 U$4.8
N$50
  Bottom 0.61: NIX_LOW.2 5.84,68.33 8.26,70.75 U$4.5 U$4.6
N$51
  Bottom 0.305: U$1.15 48.95,68.51 48.51,68.07
  Bottom 0.406: U$2.2 45.24,62.26
  Bottom 0.61: 48.51,68.07 48.01,68.07 46.74,66.8 | 46.74,66.8 46.74,63.75 45.24,62.26 | R14.1 46.23,67.31 46.74,66.8
N$52
  Bottom 0.61: NIX_LOW.3 5.84,65.79 7.74,67.69 U$6.7 U$6.8
N$53
  Bottom 0.61: NIX_LOW.4 6.1,63.25 8,65.14 U$6.5 U$6.6
N$54
  Bottom 0.61: NIX_LOW.5 5.84,60.71 7.23,62.1 U$7.7 U$7.8
N$55
  Bottom 0.61: NIX_LOW.6 6.1,58.17 7.49,59.56 U$7.5 U$7.6
N$56
  Bottom 0.61: NIX_LOW.7 6.1,55.63 6.98,56.51 U$8.7 U$8.8
N$57
  Bottom 0.61: NIX_LOW.8 6.1,53.09 6.98,53.97 U$8.5 U$8.6
N$58
  Bottom 0.61: NIX_LOW.9 5.84,50.55 6.22,50.92 U$9.7 U$9.8
N$59
  Bottom 0.305: U$1.14 49.83,67.86 48.51,66.55
  Bottom 0.406: U$2.3 46.01,60.99
  Bottom 0.61: 46.01,60.99 48.51,63.5 | 48.51,63.5 48.51,63.75 48.51,66.55 | R15.1 48.51,63.5
N$60
  Bottom 0.61: NIX_LOW.10 6.1,48.01 6.47,48.38 U$9.5 U$9.6
N$61
  Bottom 0.406: U$3.10 30.12,40.03 29.21,39.12
  Bottom 0.61: U$12.2 17.18,30.82 17.42,30.58 RN1.3 RN4.3 25.76,30.58 27.43,32.26 27.43,37.34 29.21,39.12
N$62  (via drill 0.5 pad 1.5)
  other vias: 3,77
N$63
  Bottom 0.406: U$3.11 29.48,40.91 28.45,39.88
  Bottom 0.61: U$13.4 16.63,35.69 17.02,35.31 17.02,34.04 17.93,33.12 RN1.2 RN4.2 25.25,33.12 26.16,34.04 26.16,37.59 28.45,39.88
N$64
  Bottom 0.406: U$3.12 28.82,41.52 28.45,41.15 26.16,41.15
  Bottom 0.61: U$13.2 16.9,38.23 17.53,38.86 17.53,40.89 17.93,41.3 RN3.2 RN5.2 26.01,41.3 26.16,41.15
N$65
  Bottom 0.406: U$3.13 28.18,42.15 27.94,41.91 26.92,41.91 24.99,43.84 RN5.3
  Bottom 0.61: U$14.4 16.79,42.95 17.68,43.84 RN3.3 RN5.3
N$66  (via drill 0.5 pad 1.5)
  other vias: 59.3,49.6
N$67
  Bottom 0.61: 5V_SUPP1.2 59.82,10.26 IC3.1
N$68
  Bottom 0.406: U$3.14 27.25,43.62 24.49,46.38 RN5.4
  Bottom 0.61: U$14.2 17.04,45.49 17.93,46.38 RN3.4 RN5.4
N$69
  Bottom 0.61: NIX_HIGH.3 6.1,40.39 6.98,39.5 U$13.8 U$13.7
N$70
  Bottom 0.61: NIX_HIGH.4 5.84,37.85 6.72,36.96 U$13.6 U$13.5
N$71
  Bottom 0.61: NIX_HIGH.5 5.08,35.31 8.29,32.09 U$12.8 U$12.7
N$72
  Bottom 0.61: NIX_HIGH.6 5.08,32.77 6.86,30.99 6.86,30.48 7.79,29.55 U$12.6 U$12.5
N$73
  Bottom 0.61: NIX_HIGH.7 5.08,30.23 7.37,27.94 7.37,27.18 7.85,26.69 U$11.8 U$11.7
N$74
  Bottom 0.61: NIX_HIGH.8 4.83,27.69 7.37,25.15 7.37,24.64 7.85,24.15 U$11.6 U$11.5
N$75
  Bottom 0.61: NIX_HIGH.9 4.57,25.15 7.37,22.35 7.37,21.59 7.75,21.2 U$10.8 U$10.7
N$76
  Bottom 0.61: NIX_HIGH.10 4.83,22.61 6.1,21.34 6.1,20.32 7.75,18.66 U$10.6 U$10.5
N$77  (via drill 0.5 pad 1.5)
  other vias: 59.3,24.6
PWM
  Bottom 0.305: U$1.7 54.61,67.86
  Bottom 0.61: 54.61,67.86 54.36,67.61 54.36,55.88 56.13,54.1 61.98,54.1 64.01,52.07 64.01,30.48 62.48,28.96 56.9,28.96 54.1,31.75 R16.2
RXD  (via drill 0.5 pad 1.5)
  Top 0.61: IC1.12 47.08,48.86 50.04,52.07 50.04,67.31 55.12,72.39 v58.17,72.39
  Bottom 0.305: U$1.3 57.51,70.46 57.91,70.87 57.91,72.14 v58.17,72.39
TXD  (via drill 0.5 pad 1.5)
  Top 0.61: IC1.11 48.35,48.35 52.07,52.07 52.07,66.55 55.63,70.1 v58.93,70.1
  Bottom 0.305: U$1.4 58.63,69.81 v58.93,70.1
VHIGH
  Bottom 0.61: NIX_HIGH.12 3.3,14.48 4.83,12.95 HV_EN.2
VHIGH_SUP
  Bottom 0.61: 28.96,5.33 28.45,5.84 24.38,5.84 23.94,6.28 R8.1 23.94,12.38 D2.C 21.84,14.48 11.94,14.48 10.41,12.95 HV_EN.1 | 28.96,5.33 C5.2 | C4.+ 29.72,4.57 28.96,5.33

### Text on the board
Top: Low1 | Low9 | Low0 | High1 | AP20 Remote Fader rev.3 / Filmstudio an der RWTH Aachen e.V. / Martin Gritzan, 2015 | DANGER! HIGH VOLTAGE! | High9 | High0 | GNDA | +200V | top
Bottom: bot